# EAGLE design power (EAGLE 6.1)
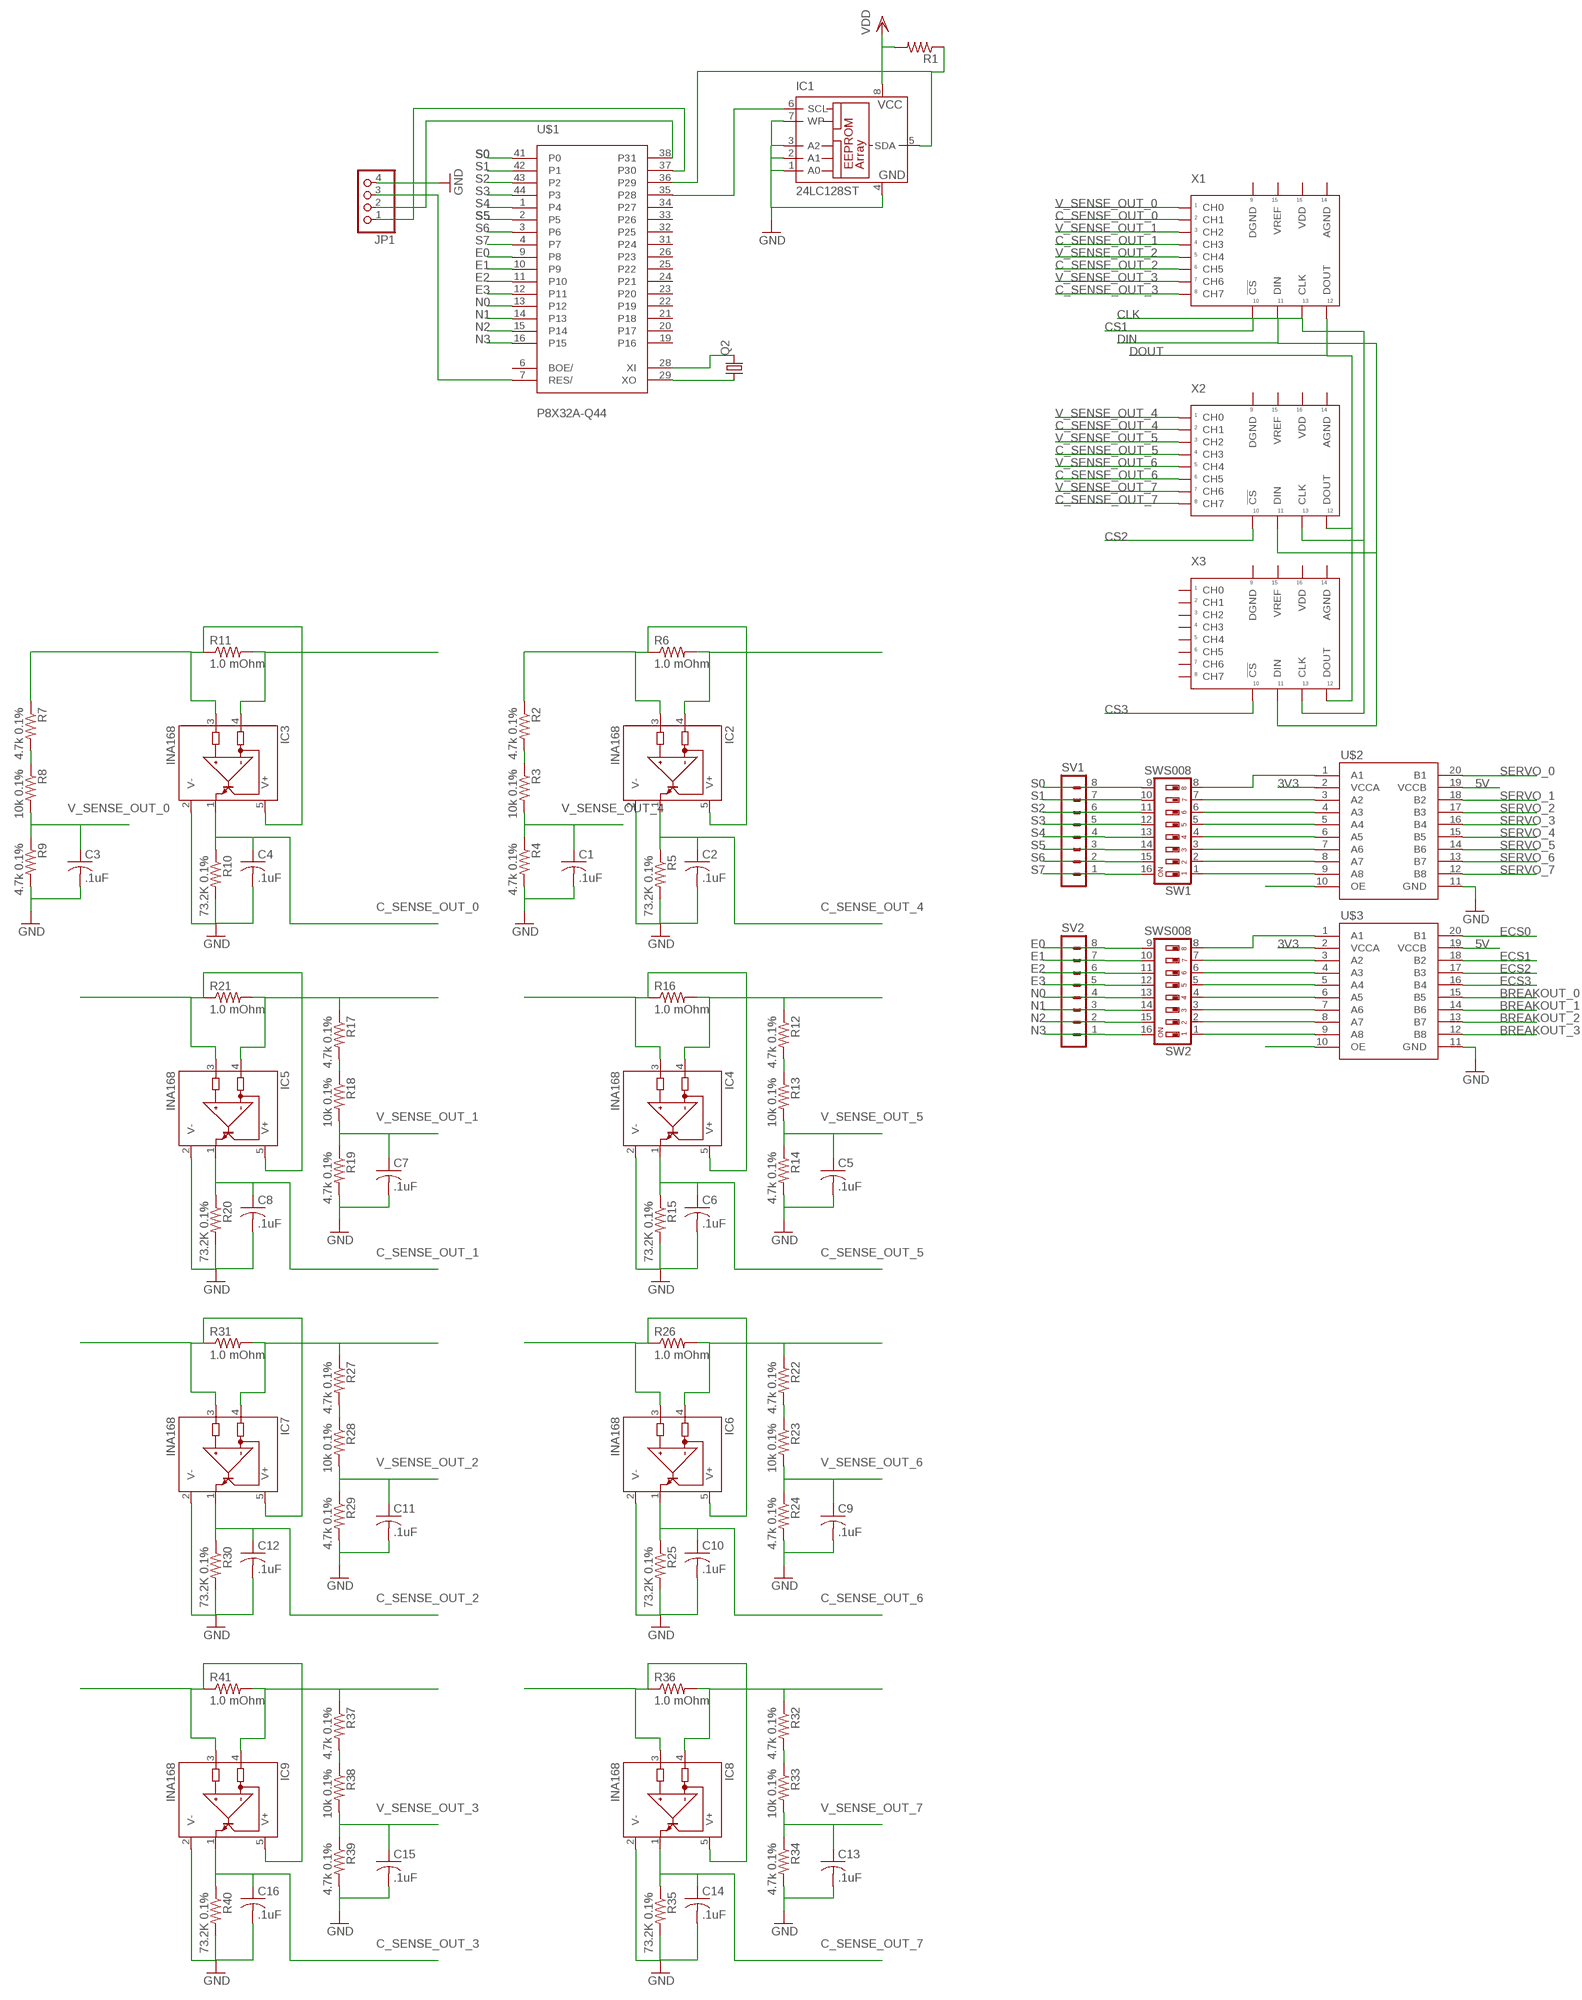
[diagram p0: schematic, sheet 1]

## Parts
C1  .1uF  C-USC0805  [C0805]
C2  .1uF  C-USC0805  [C0805]
C3  .1uF  C-USC0805  [C0805]
C4  .1uF  C-USC0805  [C0805]
C5  .1uF  C-USC0805  [C0805]
C6  .1uF  C-USC0805  [C0805]
C7  .1uF  C-USC0805  [C0805]
C8  .1uF  C-USC0805  [C0805]
C9  .1uF  C-USC0805  [C0805]
C10  .1uF  C-USC0805  [C0805]
C11  .1uF  C-USC0805  [C0805]
C12  .1uF  C-USC0805  [C0805]
C13  .1uF  C-USC0805  [C0805]
C14  .1uF  C-USC0805  [C0805]
C15  .1uF  C-USC0805  [C0805]
C16  .1uF  C-USC0805  [C0805]
IC1  24LC128ST  [TSSOP8]
IC2  INA168  [SOT23-5]
IC3  INA168  [SOT23-5]
IC4  INA168  [SOT23-5]
IC5  INA168  [SOT23-5]
IC6  INA168  [SOT23-5]
IC7  INA168  [SOT23-5]
IC8  INA168  [SOT23-5]
IC9  INA168  [SOT23-5]
JP1  PINHD-1X4/90  [1X04/90]
Q2  CRYSTALHC49S  [HC49/S]
R1  R-US_M0805  [M0805]
R2  4.7k 0.1%  RESISTOR0805-RES  [0805]
R3  10k 0.1%  RESISTOR0805-RES  [0805]
R4  4.7k 0.1%  RESISTOR0805-RES  [0805]
R5  73.2K 0.1%  RESISTOR0805-RES  [0805]
R6  1.0 mOhm  R-US_R2512  [R2512]
R7  4.7k 0.1%  RESISTOR0805-RES  [0805]
R8  10k 0.1%  RESISTOR0805-RES  [0805]
R9  4.7k 0.1%  RESISTOR0805-RES  [0805]
R10  73.2K 0.1%  RESISTOR0805-RES  [0805]
R11  1.0 mOhm  R-US_R2512  [R2512]
R12  4.7k 0.1%  RESISTOR0805-RES  [0805]
R13  10k 0.1%  RESISTOR0805-RES  [0805]
R14  4.7k 0.1%  RESISTOR0805-RES  [0805]
R15  73.2K 0.1%  RESISTOR0805-RES  [0805]
R16  1.0 mOhm  R-US_R2512  [R2512]
R17  4.7k 0.1%  RESISTOR0805-RES  [0805]
R18  10k 0.1%  RESISTOR0805-RES  [0805]
R19  4.7k 0.1%  RESISTOR0805-RES  [0805]
R20  73.2K 0.1%  RESISTOR0805-RES  [0805]
R21  1.0 mOhm  R-US_R2512  [R2512]
R22  4.7k 0.1%  RESISTOR0805-RES  [0805]
R23  10k 0.1%  RESISTOR0805-RES  [0805]
R24  4.7k 0.1%  RESISTOR0805-RES  [0805]
R25  73.2K 0.1%  RESISTOR0805-RES  [0805]
R26  1.0 mOhm  R-US_R2512  [R2512]
R27  4.7k 0.1%  RESISTOR0805-RES  [0805]
R28  10k 0.1%  RESISTOR0805-RES  [0805]
R29  4.7k 0.1%  RESISTOR0805-RES  [0805]
R30  73.2K 0.1%  RESISTOR0805-RES  [0805]
R31  1.0 mOhm  R-US_R2512  [R2512]
R32  4.7k 0.1%  RESISTOR0805-RES  [0805]
R33  10k 0.1%  RESISTOR0805-RES  [0805]
R34  4.7k 0.1%  RESISTOR0805-RES  [0805]
R35  73.2K 0.1%  RESISTOR0805-RES  [0805]
R36  1.0 mOhm  R-US_R2512  [R2512]
R37  4.7k 0.1%  RESISTOR0805-RES  [0805]
R38  10k 0.1%  RESISTOR0805-RES  [0805]
R39  4.7k 0.1%  RESISTOR0805-RES  [0805]
R40  73.2K 0.1%  RESISTOR0805-RES  [0805]
R41  1.0 mOhm  R-US_R2512  [R2512]
SV1  MA08-1  [MA08-1]
SV2  MA08-1  [MA08-1]
SW1  SWS008  [SMS-008]
SW2  SWS008  [SMS-008]
U$1  P8X32A-Q44  [P8X32A-Q44]
U$2  TXB0108PWR  [TSSOP20]
U$3  TXB0108PWR  [TSSOP20]
X1  21298ESMD  [PDIP16]
X2  21298ESMD  [PDIP16]
X3  21298ESMD  [PDIP16]

## Nets
3V3: U$2.2(VCCA) U$3.2(VCCA)
5V: U$2.19(VCCB) U$3.19(VCCB)
BREAKOUT_0: U$3.15(B5)
BREAKOUT_1: U$3.14(B6)
BREAKOUT_2: U$3.13(B7)
BREAKOUT_3: U$3.12(B8)
C_SENSE_OUT_0: C4.1 IC3.1(OUT) R10.1 X1.P$2(CH1)
C_SENSE_OUT_1: C8.1 IC5.1(OUT) R20.1 X1.P$4(CH3)
C_SENSE_OUT_2: C12.1 IC7.1(OUT) R30.1 X1.P$6(CH5)
C_SENSE_OUT_3: C16.1 IC9.1(OUT) R40.1 X1.P$8(CH7)
C_SENSE_OUT_4: C2.1 IC2.1(OUT) R5.1 X2.P$2(CH1)
C_SENSE_OUT_5: C6.1 IC4.1(OUT) R15.1 X2.P$4(CH3)
C_SENSE_OUT_6: C10.1 IC6.1(OUT) R25.1 X2.P$6(CH5)
C_SENSE_OUT_7: C14.1 IC8.1(OUT) R35.1 X2.P$8(CH7)
CLK: X1.P$13(CLK) X2.P$13(CLK) X3.P$13(CLK)
CS1: X1.P$10(!CS)
CS2: X2.P$10(!CS)
CS3: X3.P$10(!CS)
DIN: X1.P$11(DIN) X2.P$11(DIN) X3.P$11(DIN)
DOUT: X1.P$12(DOUT) X2.P$12(DOUT) X3.P$12(DOUT)
E0: SV2.8 SW2.9 U$1.9(P8)
E1: SV2.7 SW2.10 U$1.10(P9)
E2: SV2.6 SW2.11 U$1.11(P10)
E3: SV2.5 SW2.12 U$1.12(P11)
ECS0: U$3.20(B1)
ECS1: U$3.18(B2)
ECS2: U$3.17(B3)
ECS3: U$3.16(B4)
GND: C1.2 C2.2 C3.2 C4.2 C5.2 C6.2 C7.2 C8.2 C9.2 C10.2 C11.2 C12.2 C13.2 C14.2 C15.2 C16.2 IC1.1(A0) IC1.2(A1) IC1.3(A2) IC1.4(GND) IC1.7(WP) IC2.2(V-) IC3.2(V-) IC4.2(V-) IC5.2(V-) IC6.2(V-) IC7.2(V-) IC8.2(V-) IC9.2(V-) JP1.4 R4.2 R5.2 R9.2 R10.2 R14.2 R15.2 R19.2 R20.2 R24.2 R25.2 R29.2 R30.2 R34.2 R35.2 R39.2 R40.2 U$2.11(GND) U$3.11(GND)
N0: SV2.4 SW2.13 U$1.13(P12)
N1: SV2.3 SW2.14 U$1.14(P13)
N2: SV2.2 SW2.15 U$1.15(P14)
N3: SV2.1 SW2.16 U$1.16(P15)
N$1: JP1.1 U$1.37(P30)
N$2: JP1.2 U$1.38(P31)
N$3: IC1.6(SCL) U$1.35(P28)
N$4: IC1.5(SDA) R1.1 U$1.36(P29)
N$5: Q2.1 U$1.29(XO)
N$6: Q2.2 U$1.28(XI)
N$7: JP1.3 U$1.7(RES/)
N$8: IC2.4(IN-) R6.2
N$9: IC2.3(IN+) IC2.5(V+) R2.1 R6.1
N$10: IC3.4(IN-) R11.2
N$11: IC3.3(IN+) IC3.5(V+) R7.1 R11.1
N$12: R2.2 R3.1
N$13: R7.2 R8.1
N$14: IC4.4(IN-) R12.1 R16.2
N$15: IC4.3(IN+) IC4.5(V+) R16.1
N$16: R12.2 R13.1
N$17: IC5.4(IN-) R17.1 R21.2
N$18: IC5.3(IN+) IC5.5(V+) R21.1
N$19: R17.2 R18.1
N$20: IC6.4(IN-) R22.1 R26.2
N$21: IC6.3(IN+) IC6.5(V+) R26.1
N$22: R22.2 R23.1
N$23: IC7.4(IN-) R27.1 R31.2
N$24: IC7.3(IN+) IC7.5(V+) R31.1
N$25: R27.2 R28.1
N$26: IC8.4(IN-) R32.1 R36.2
N$27: IC8.3(IN+) IC8.5(V+) R36.1
N$28: R32.2 R33.1
N$29: IC9.4(IN-) R37.1 R41.2
N$30: IC9.3(IN+) IC9.5(V+) R41.1
N$31: R37.2 R38.1
N$32: SW1.8 U$2.1(A1)
N$33: SW1.7 U$2.3(A2)
N$34: SW1.6 U$2.4(A3)
N$35: SW1.5 U$2.5(A4)
N$36: SW1.4 U$2.6(A5)
N$37: SW1.3 U$2.7(A6)
N$38: SW1.2 U$2.8(A7)
N$39: SW1.1 U$2.9(A8)
N$40: U$2.10(OE)
N$41: SW2.8 U$3.1(A1)
N$42: SW2.7 U$3.3(A2)
N$43: SW2.6 U$3.4(A3)
N$44: SW2.5 U$3.5(A4)
N$45: SW2.4 U$3.6(A5)
N$46: SW2.3 U$3.7(A6)
N$47: SW2.2 U$3.8(A7)
N$48: SW2.1 U$3.9(A8)
N$49: U$3.10(OE)
S0: SV1.8 SW1.9 U$1.41(P0)
S1: SV1.7 SW1.10 U$1.42(P1)
S2: SV1.6 SW1.11 U$1.43(P2)
S3: SV1.5 SW1.12 U$1.44(P3)
S4: SV1.4 SW1.13 U$1.1(P4)
S5: SV1.3 SW1.14 U$1.2(P5)
S6: SV1.2 SW1.15 U$1.3(P6)
S7: SV1.1 SW1.16 U$1.4(P7)
SERVO_0: U$2.20(B1)
SERVO_1: U$2.18(B2)
SERVO_2: U$2.17(B3)
SERVO_3: U$2.16(B4)
SERVO_4: U$2.15(B5)
SERVO_5: U$2.14(B6)
SERVO_6: U$2.13(B7)
SERVO_7: U$2.12(B8)
V_SENSE_OUT_0: C3.1 R8.2 R9.1 X1.P$1(CH0)
V_SENSE_OUT_1: C7.1 R18.2 R19.1 X1.P$3(CH2)
V_SENSE_OUT_2: C11.1 R28.2 R29.1 X1.P$5(CH4)
V_SENSE_OUT_3: C15.1 R38.2 R39.1 X1.P$7(CH6)
V_SENSE_OUT_4: C1.1 R3.2 R4.1 X2.P$1(CH0)
V_SENSE_OUT_5: C5.1 R13.2 R14.1 X2.P$3(CH2)
V_SENSE_OUT_6: C9.1 R23.2 R24.1 X2.P$5(CH4)
V_SENSE_OUT_7: C13.1 R33.2 R34.1 X2.P$7(CH6)
VDD: IC1.8(VCC) R1.2
Unconnected: U$1.6(BOE/) U$1.19(P16) U$1.20(P17) U$1.21(P18) U$1.22(P19) U$1.23(P20) U$1.24(P21) U$1.25(P22) U$1.26(P23) U$1.31(P24) U$1.32(P25) U$1.33(P26) U$1.34(P27) X1.P$9(DGND) X1.P$14(AGND) X1.P$15(VREF) X1.P$16(VDD) X2.P$9(DGND) X2.P$14(AGND) X2.P$15(VREF) X2.P$16(VDD) X3.P$1(CH0) X3.P$2(CH1) X3.P$3(CH2) X3.P$4(CH3) X3.P$5(CH4) X3.P$6(CH5) X3.P$7(CH6) X3.P$8(CH7) X3.P$9(DGND) X3.P$14(AGND) X3.P$15(VREF) X3.P$16(VDD)

## Power pins joined to a net without a drawn wire
VDD: U$1.8(VDD) U$1.18(VDD) U$1.30(VDD) U$1.40(VDD)
VSS: U$1.5(VSS) U$1.17(VSS) U$1.27(VSS) U$1.39(VSS)

## Library data of the parts
C1-C16 = resistor:C-US: CAPACITOR, American symbol
IC1 = microchip:24*: Serial EEPROM I2C; MF: MICROCHIP; MPN: 24LC128-I/ST; OC_FARNELL: 1296573; OC_NEWARK: 62K0578
IC2-IC9 = burr-brown:INA168: High-Side Measurement Current Shunt Monitor; MF: TEXAS INSTRUMENTS; MPN: INA168NA/250; OC_FARNELL: 4375737; OC_NEWARK: 35C1744
JP1 = pinhead:PINHD-1X4: PIN HEADER
Q2 = crystal:CRYSTAL: CRYSTAL; OC_FARNELL: 1667008; OC_NEWARK: unknown
R1 = resistor:R-US_: RESISTOR, American symbol
R2-R5 R7-R10 R12-R15 R17-R20 R22-R25 R27-R30 R32-R35 R37-R40 = SparkFun:RESISTOR: Resistor Basic schematic elements and footprints for 0603, 1206, and PTH resistors.
R6 R11 R16 R21 R26 R31 R36 R41 = rcl:R-US_: RESISTOR, American symbol
SV1 SV2 = con-lstb:MA08-1: PIN HEADER; OC_FARNELL: unknown; OC_NEWARK: unknown
SW1 SW2 = smd-special:SWS008: SMD Dip Switch 8 pol.
U$1 = parallax_propeller:P8X32A-Q44
U$2 U$3 = SparkFun:TXB0108PWR: Logic level shifter. TSSOP20
X1-X3 = Microchip (2):21298E

## Board
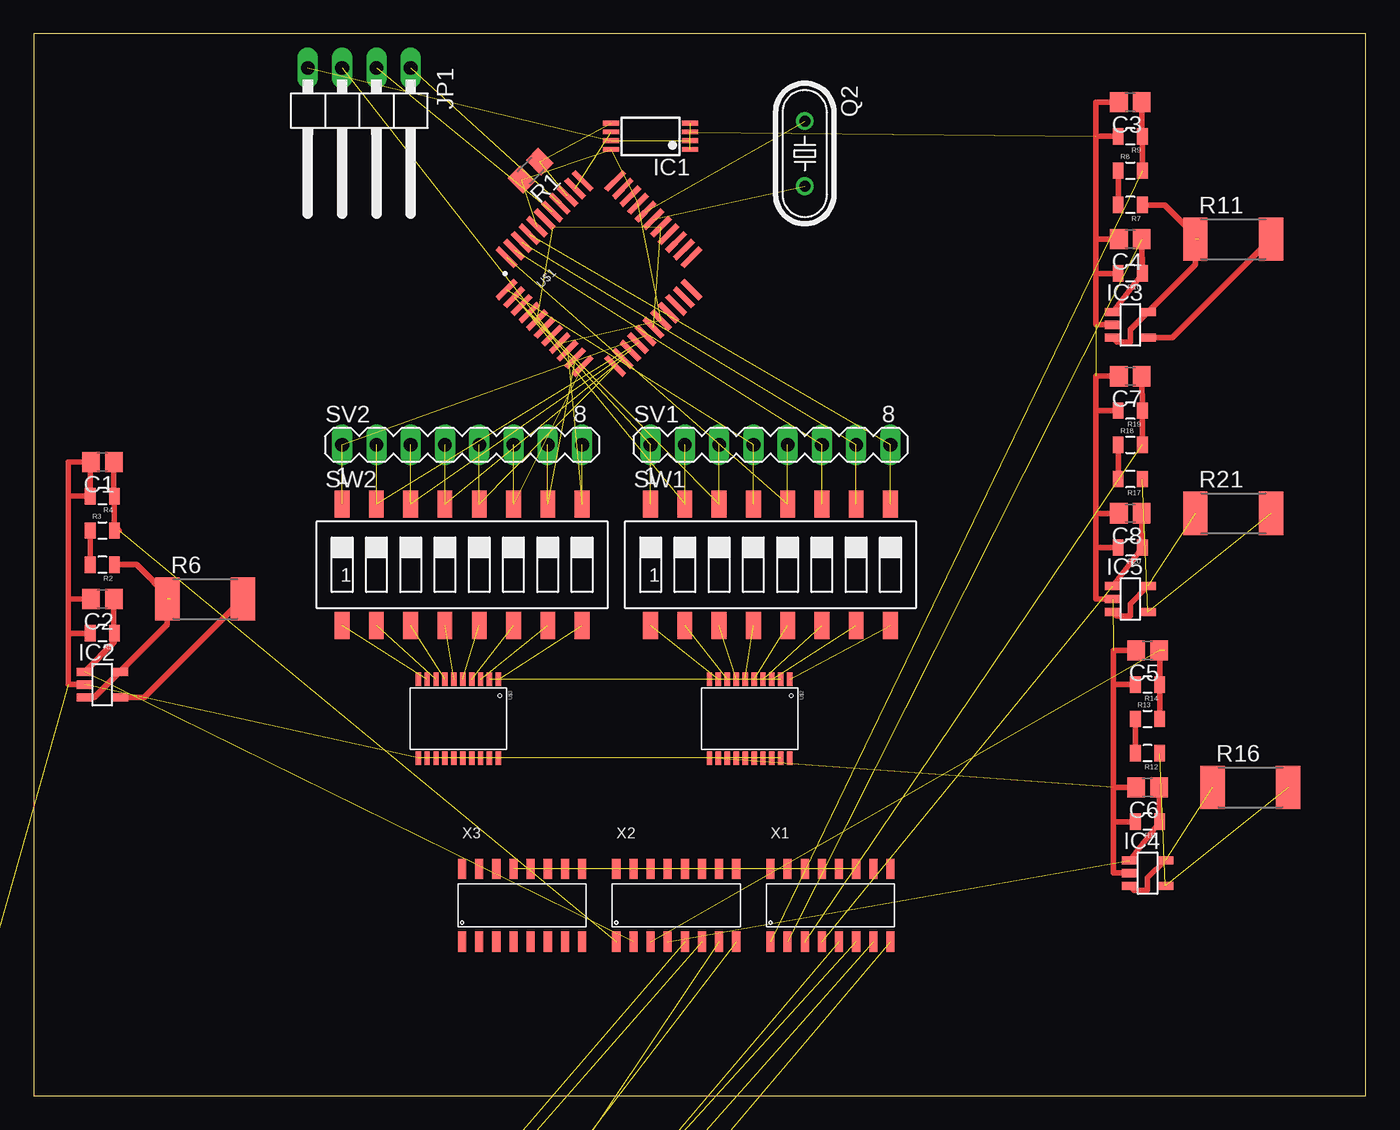
[diagram p1: board, top side]

Size 98.73 x 78.73 mm. Coordinates in mm from the lower left corner, seen from the top.
Outline: 0,0 98.73,0 98.73,78.73 0,78.73 0,0
Copper layers (1*16): Top 0.035mm / dielectric 1.5mm / Bottom 0.035mm
Design rules: minimum track width 10mil, minimum drill 24mil, track to track 8mil, track to pad 8mil, pad to pad 8mil, via to via 8mil, smd to smd 8mil, copper to edge 40mil, drill to drill 8mil, minimum pad ring 10mil, minimum via ring 8mil, stop-mask expansion 4mil, vias tented up to drill 0mil, thermal gap 10mil

### Footprints (pad centres in the part's own frame; a part is rotated, then mirrored left to right if it is on the bottom)
C0805 = smd 1.3 x 1.5: 1 -0.85,0; 2 0.85,0
TSSOP8 = smd 0.35 x 1.2: 1 -0.975,-2.925; 2 -0.325,-2.925; 3 0.325,-2.925; 4 0.975,-2.925; 5 0.975,2.925; 6 0.325,2.925; 7 -0.325,2.925; 8 -0.975,2.925
SOT23-5 = smd 0.6 x 1.2: 1 -0.95,-1.306; 2 0,-1.306; 3 0.95,-1.306; 4 0.95,1.306; 5 -0.95,1.306
1X04/90 = drill 1.016 long: 1 -3.81,-3.81; 2 -1.27,-3.81; 3 1.27,-3.81; 4 3.81,-3.81
HC49/S = drill 0.813: 1 -2.413,0; 2 2.413,0
M0805 = smd 1.3 x 1.6: 1 -0.95,0; 2 0.95,0
0805 = smd 0.8 x 1.2: 1 -0.9,0; 2 0.9,0
R2512 = smd 1.8 x 3.2: 1 -2.8,0; 2 2.8,0
MA08-1 = drill 1.016 long: 1 -8.89,0; 2 -6.35,0; 3 -3.81,0; 4 -1.27,0; 5 1.27,0; 6 3.81,0; 7 6.35,0; 8 8.89,0
SMS-008 = smd 1.092 x 2.007: 1 -8.89,-4.496; 2 -6.35,-4.496; 3 -3.81,-4.496; 4 -1.27,-4.496; 5 1.27,-4.496; 6 3.81,-4.496; 7 6.35,-4.496; 8 8.89,-4.496; 9 8.89,4.496; 10 6.35,4.496; 11 3.81,4.496; 12 1.27,4.496; 13 -1.27,4.496; 14 -3.81,4.496; 15 -6.35,4.496; 16 -8.89,4.496
P8X32A-Q44 = smd 1.9 x 0.4: 1 -5.713,4.013; 2 -5.713,3.212; 3 -5.713,2.413; 4 -5.713,1.613; 5 -5.713,0.812; 6 -5.713,0.013; 7 -5.713,-0.787; 8 -5.713,-1.587; 9 -5.713,-2.388; 10 -5.713,-3.188; 11 -5.713,-3.987; 23 5.688,-3.987; 24 5.688,-3.188; 25 5.688,-2.388; 26 5.688,-1.587; 27 5.688,-0.787; 28 5.688,0.013; 29 5.688,0.812; 30 5.688,1.613; 31 5.688,2.413; 32 5.688,3.212; 33 5.688,4.013 | smd 0.4 x 1.9: 12 -4.013,-5.688; 13 -3.212,-5.688; 14 -2.413,-5.688; 15 -1.613,-5.688; 16 -0.812,-5.688; 17 -0.013,-5.688; 18 0.787,-5.688; 19 1.587,-5.688; 20 2.388,-5.688; 21 3.188,-5.688; 22 3.987,-5.688; 34 3.987,5.713; 35 3.188,5.713; 36 2.388,5.713; 37 1.587,5.713; 38 0.787,5.713; 39 -0.013,5.713; 40 -0.812,5.713; 41 -1.613,5.713; 42 -2.413,5.713; 43 -3.212,5.713; 44 -4.013,5.713
TSSOP20 = smd 1 x 0.4: 1 -2.937,2.693; 2 -2.937,2.032; 3 -2.937,1.372; 4 -2.937,0.712; 5 -2.937,0.051; 6 -2.937,-0.609; 7 -2.937,-1.27; 8 -2.943,-1.93; 9 -2.937,-2.59; 10 -2.937,-3.251; 11 2.905,-3.251; 12 2.905,-2.59; 13 2.911,-1.93; 14 2.905,-1.27; 15 2.905,-0.609; 16 2.905,0.051; 17 2.905,0.712; 18 2.905,1.372; 19 2.905,2.032; 20 2.905,2.693
PDIP16 = smd 0.6 x 1.5: P$1 0,0; P$2 1.27,0; P$3 2.54,0; P$4 3.81,0; P$5 5.08,0; P$6 6.35,0; P$7 7.62,0; P$8 8.89,0; P$9 8.89,5.4; P$10 7.62,5.4; P$11 6.35,5.4; P$12 5.08,5.4; P$13 3.81,5.4; P$14 2.54,5.4; P$15 1.27,5.4; P$16 0,5.4

### Placement (x,y rotation side)
C1  5.08,46.99 180 top
C2  5.08,36.83 180 top
C3  81.28,73.66 180 top
C4  81.28,63.5 180 top
C5  82.55,33.02 180 top
C6  82.55,22.86 180 top
C7  81.28,53.34 180 top
C8  81.28,43.18 180 top
C9  -54.61,-109.22 0 top  (outside the outline)
C10  -48.26,-109.22 0 top  (outside the outline)
C11  -41.91,-109.22 0 top  (outside the outline)
C12  -35.56,-109.22 0 top  (outside the outline)
C13  -62.23,-115.57 0 top  (outside the outline)
C14  -55.88,-115.57 0 top  (outside the outline)
C15  -49.53,-115.57 0 top  (outside the outline)
C16  -43.18,-115.57 0 top  (outside the outline)
IC1  45.72,71.12 90 top
IC2  5.08,30.48 270 top
IC3  81.28,57.15 270 top
IC4  82.55,16.51 270 top
IC5  81.28,36.83 270 top
IC6  -50.8,-102.87 0 top  (outside the outline)
IC7  -43.18,-102.87 0 top  (outside the outline)
IC8  -35.56,-102.87 0 top  (outside the outline)
IC9  -60.96,-110.49 0 top  (outside the outline)
JP1  24.13,72.39 180 top
Q2  57.15,69.85 270 top
R1  36.83,68.58 225 top
R2  5.08,39.37 180 top
R3  5.08,41.91 0 top
R4  5.08,44.45 180 top
R5  5.08,34.29 180 top
R6  12.7,36.83 0 top
R7  81.28,66.04 180 top
R8  81.28,68.58 0 top
R9  81.28,71.12 180 top
R10  81.28,60.96 180 top
R11  88.9,63.5 0 top
R12  82.55,25.4 180 top
R13  82.55,27.94 0 top
R14  82.55,30.48 180 top
R15  82.55,20.32 180 top
R16  90.17,22.86 0 top
R17  81.28,45.72 180 top
R18  81.28,48.26 0 top
R19  81.28,50.8 180 top
R20  81.28,40.64 180 top
R21  88.9,43.18 0 top
R22  -55.88,-120.65 0 top  (outside the outline)
R23  -59.69,-124.46 0 top  (outside the outline)
R24  -52.07,-120.65 0 top  (outside the outline)
R25  -38.1,-114.3 0 top  (outside the outline)
R26  -60.96,-93.98 0 top  (outside the outline)
R27  -48.26,-120.65 0 top  (outside the outline)
R28  -55.88,-124.46 0 top  (outside the outline)
R29  -44.45,-120.65 0 top  (outside the outline)
R30  -34.29,-114.3 0 top  (outside the outline)
R31  -49.53,-93.98 0 top  (outside the outline)
R32  -40.64,-120.65 0 top  (outside the outline)
R33  -52.07,-124.46 0 top  (outside the outline)
R34  -36.83,-120.65 0 top  (outside the outline)
R35  -63.5,-120.65 0 top  (outside the outline)
R36  -38.1,-93.98 0 top  (outside the outline)
R37  -33.02,-120.65 0 top  (outside the outline)
R38  -48.26,-124.46 0 top  (outside the outline)
R39  -63.5,-124.46 0 top  (outside the outline)
R40  -59.69,-120.65 0 top  (outside the outline)
R41  -60.96,-101.6 0 top  (outside the outline)
SV1  54.61,48.26 0 top
SV2  31.75,48.26 0 top
SW1  54.61,39.37 0 top
SW2  31.75,39.37 0 top
U$1  41.91,60.96 45 top
U$2  53.34,27.94 270 top
U$3  31.75,27.94 270 top
X1  54.61,11.43 0 top
X2  43.18,11.43 0 top
X3  31.75,11.43 0 top

### Tracks (layer width: path | path; a pad name or v marks a point on that pad's centre or on a via)
3V3  (1 unrouted)
5V  (1 unrouted)
C_SENSE_OUT_0  (1 unrouted)
  Top 0.406: IC3.1 R10.1 C4.1
C_SENSE_OUT_1  (1 unrouted)
  Top 0.406: C8.1 R20.1 IC5.1
C_SENSE_OUT_2  (3 unrouted)
C_SENSE_OUT_3  (3 unrouted)
C_SENSE_OUT_4  (1 unrouted)
  Top 0.406: IC2.1 5.98,33.64 R5.1 5.93,34.34 C2.1
C_SENSE_OUT_5  (1 unrouted)
  Top 0.406: IC4.1 R15.1 C6.1
C_SENSE_OUT_6  (3 unrouted)
C_SENSE_OUT_7  (3 unrouted)
CLK  (2 unrouted)
DIN  (2 unrouted)
DOUT  (2 unrouted)
E0  (2 unrouted)
E1  (2 unrouted)
E2  (2 unrouted)
E3  (2 unrouted)
GND  (31 unrouted)
  Top 0.406: IC2.2 2.54,30.48 2.54,34.29 | R5.2 2.54,34.29 | C2.2 2.54,36.83 | 2.54,36.83 2.54,44.45 | 2.54,44.45 R4.2 4.18,46.94 C1.2 2.54,46.99 2.54,44.45 | 2.54,36.83 2.54,34.29 | IC3.2 78.74,57.15 78.74,60.96 | R10.2 78.74,60.96 | 78.74,60.96 78.74,63.5 | C4.2 78.74,63.5 | 78.74,63.5 78.74,71.12 | R9.2 78.74,71.12 | 78.74,71.12 78.74,73.66 C3.2 | IC5.2 78.74,36.83 78.74,40.64 | R20.2 78.74,40.64 | 78.74,40.64 78.74,43.18 | C8.2 78.74,43.18 | 78.74,43.18 78.74,50.8 | R19.2 78.74,50.8 | 78.74,50.8 78.74,53.34 C7.2 | IC4.2 80.01,16.51 80.01,20.32 | 80.01,20.32 R15.2 | 80.01,20.32 80.01,22.86 | 80.01,22.86 80.01,30.48 | R14.2 80.01,30.48 | 80.01,30.48 80.01,33.02 C5.2 | C6.2 80.01,22.86
N0  (2 unrouted)
N1  (2 unrouted)
N2  (2 unrouted)
N3  (2 unrouted)
N$1  (1 unrouted)
N$2  (1 unrouted)
N$3  (1 unrouted)
N$4  (2 unrouted)
N$5  (1 unrouted)
N$6  (1 unrouted)
N$7  (1 unrouted)
N$8
  Top 0.406: IC2.4 8.2,29.53 R6.2
N$9  (1 unrouted)
  Top 0.406: R6.1 9.9,34.94 IC2.5 4.49,29.53 IC2.3 | R2.1 7.62,39.37 10.16,36.83
N$10
  Top 0.406: IC3.4 84.4,56.2 R11.2
N$11  (1 unrouted)
  Top 0.406: R11.1 86.1,61.61 IC3.5 81.28,56.79 81.28,55.88 80.29,55.88 IC3.3 | R7.1 83.82,66.04 86.36,63.5
N$12
  Top 0.406: R3.1 R2.2
N$13
  Top 0.406: R7.2 R8.1
N$14  (2 unrouted)
N$15  (1 unrouted)
  Top 0.406: IC4.3 81.56,15.24 82.55,15.24 82.55,16.15 IC4.5
N$16
  Top 0.406: R12.2 R13.1
N$17  (2 unrouted)
N$18  (1 unrouted)
  Top 0.406: IC5.3 80.29,35.56 81.28,35.56 81.28,36.47 IC5.5
N$19
  Top 0.406: R18.1 R17.2
N$20  (2 unrouted)
N$21  (2 unrouted)
N$22  (1 unrouted)
N$23  (2 unrouted)
N$24  (2 unrouted)
N$25  (1 unrouted)
N$26  (2 unrouted)
N$27  (2 unrouted)
N$28  (1 unrouted)
N$29  (2 unrouted)
N$30  (2 unrouted)
N$31  (1 unrouted)
N$32  (1 unrouted)
N$33  (1 unrouted)
N$34  (1 unrouted)
N$35  (1 unrouted)
N$36  (1 unrouted)
N$37  (1 unrouted)
N$38  (1 unrouted)
N$39  (1 unrouted)
N$41  (1 unrouted)
N$42  (1 unrouted)
N$43  (1 unrouted)
N$44  (1 unrouted)
N$45  (1 unrouted)
N$46  (1 unrouted)
N$47  (1 unrouted)
N$48  (1 unrouted)
S0  (2 unrouted)
S1  (2 unrouted)
S2  (2 unrouted)
S3  (2 unrouted)
S4  (2 unrouted)
S5  (2 unrouted)
S6  (2 unrouted)
S7  (2 unrouted)
V_SENSE_OUT_0  (1 unrouted)
  Top 0.406: R8.2 R9.1 82.13,71.12 C3.1
V_SENSE_OUT_1  (1 unrouted)
  Top 0.406: C7.1 R19.1 R18.2
V_SENSE_OUT_2  (3 unrouted)
V_SENSE_OUT_3  (3 unrouted)
V_SENSE_OUT_4  (1 unrouted)
  Top 0.406: C1.1 5.93,44.5 R4.1 R3.2 6.35,41.91
V_SENSE_OUT_5  (2 unrouted)
  Top 0.406: R14.1 R13.2 83.45,32.65 83.82,33.02
V_SENSE_OUT_6  (3 unrouted)
V_SENSE_OUT_7  (3 unrouted)
VDD  (5 unrouted)
VSS  (3 unrouted)
  Top 0.254: 38.48,64.39 37.97,64.9 U$1.39